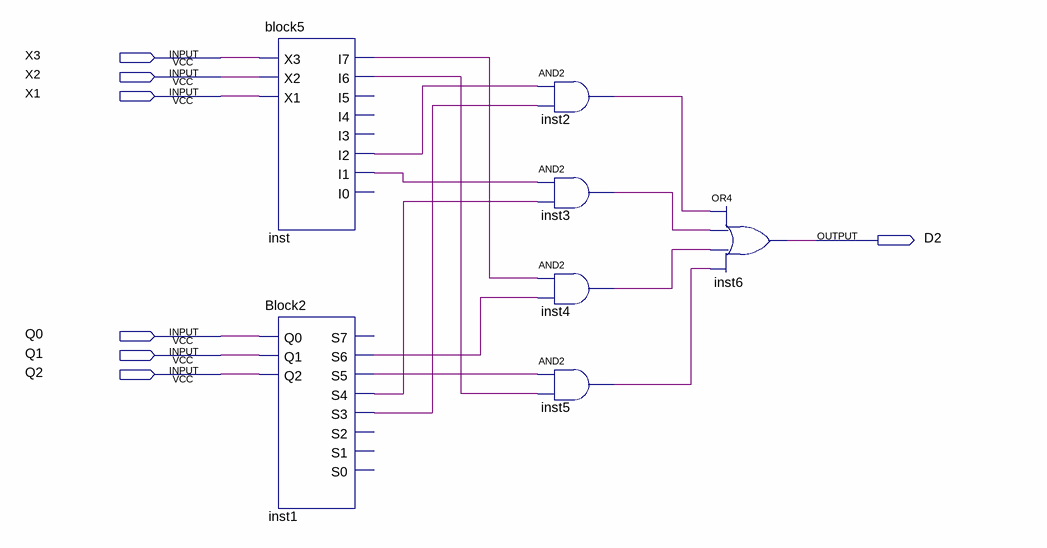
[diagram p0: schematic sheet]
// Quartus schematic block6.bdf as structural Verilog: 7 symbols, 7 pins
module block6 (
  input  X3,
  input  X2,
  input  X1,
  input  Q0,
  input  Q1,
  input  Q2,
  output D2
);

  wire inst1_s3, inst1_s4, inst1_s5, inst1_s6, inst2_out, inst3_out, inst4_out, inst5_out, inst_i1, inst_i2,
       inst_i6, inst_i7;

  block5 inst (
    .X3(X3), .X2(X2), .X1(X1), .I7(inst_i7), .I6(inst_i6), .I2(inst_i2), .I1(inst_i1));  // open: I5, I4, I3, I0
  Block2 inst1 (
    .Q0(Q0), .Q1(Q1), .Q2(Q2), .S6(inst1_s6), .S5(inst1_s5), .S4(inst1_s4), .S3(inst1_s3));  // open: S7, S2, S1, S0
  and inst2 (inst2_out, inst_i2, inst1_s3);
  and inst3 (inst3_out, inst_i1, inst1_s4);
  and inst4 (inst4_out, inst_i7, inst1_s6);
  and inst5 (inst5_out, inst1_s5, inst_i6);
  or inst6 (D2, inst2_out, inst3_out, inst4_out, inst5_out);
endmodule
